# EAGLE design POWER METER (EAGLE 9.6.2)
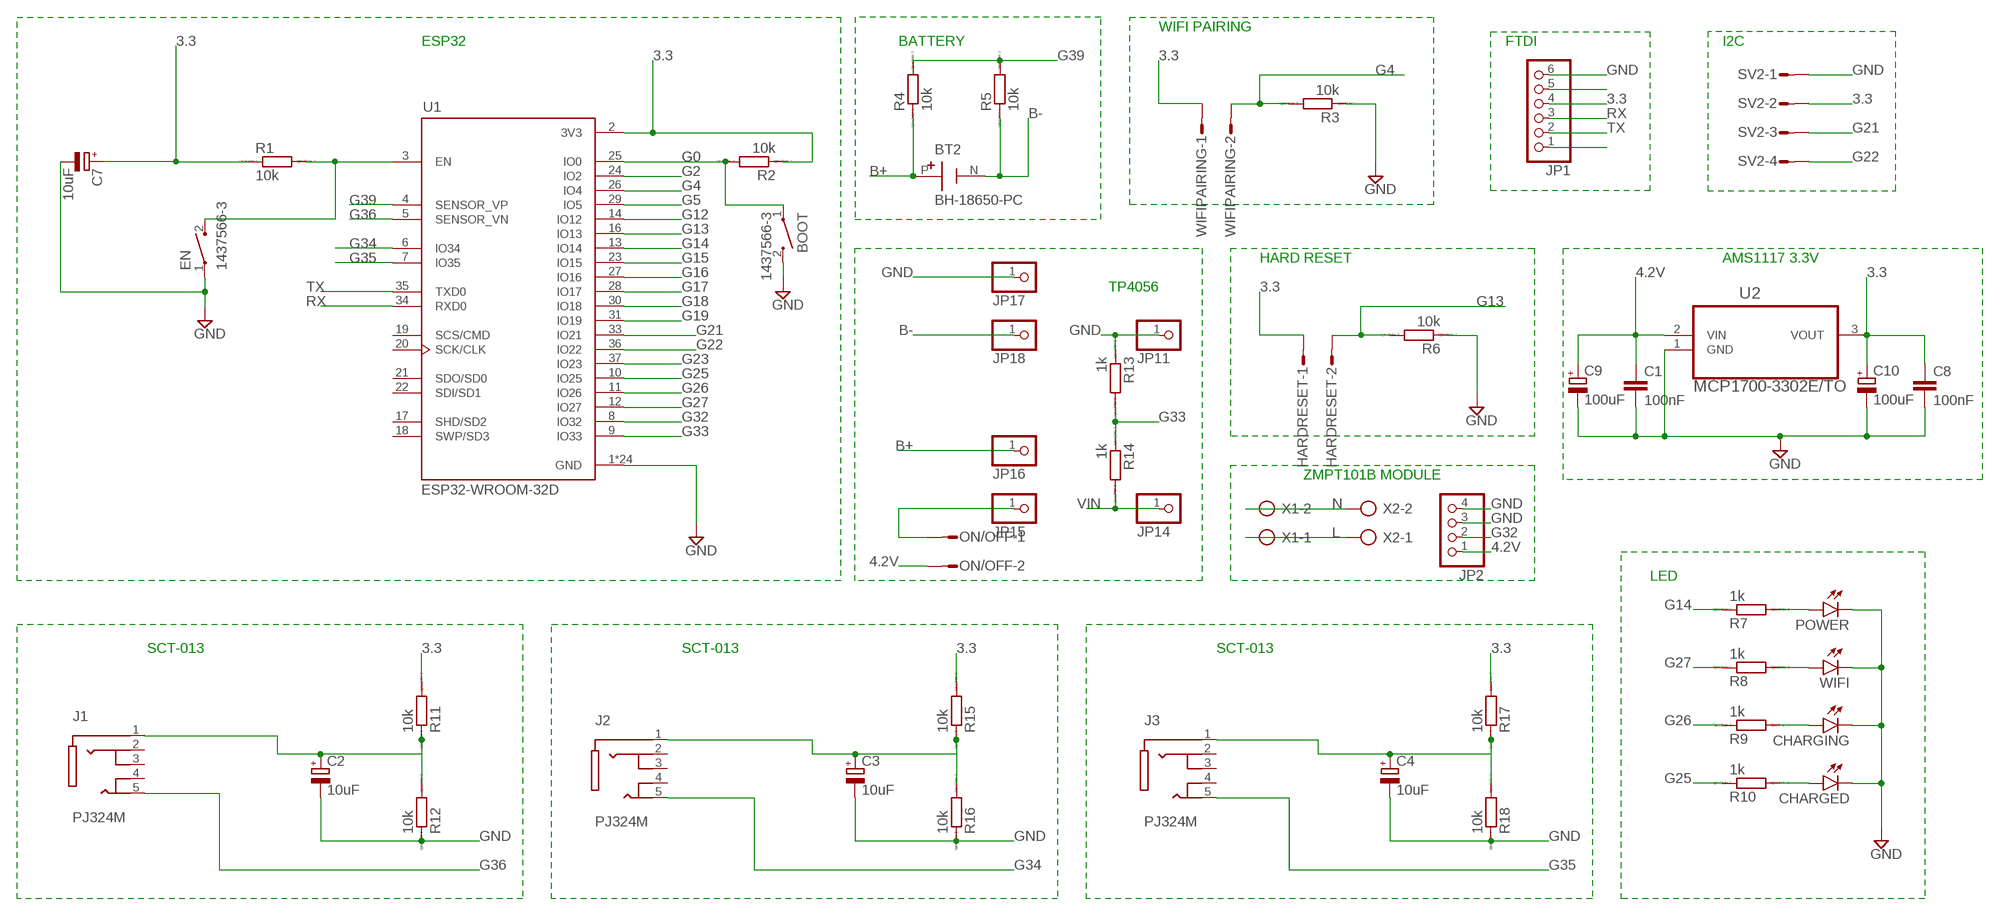
[diagram p0: schematic, sheet 1]

## Parts
BOOT  1437566-3  [SW_1437566-3]
BT2  BH-18650-PC  [BAT_BH-18650-PC]
C1  100nF  C-EUC1206K  [C1206K]
C2  10uF  CPOL-EUE2.5-6  [E2,5-6]
C3  10uF  CPOL-EUE2.5-6  [E2,5-6]
C4  10uF  CPOL-EUE2.5-6  [E2,5-6]
C7  10uF  CPOL-EUE2.5-6  [E2,5-6]
C8  100nF  C-EUC1206K  [C1206K]
C9  100uF  CPOL-EUE2.5-6  [E2,5-6]
C10  100uF  CPOL-EUE2.5-6  [E2,5-6]
CHARGED  LEDCHIPLED_1206  [CHIPLED_1206]
CHARGING  LEDCHIPLED_1206  [CHIPLED_1206]
EN  1437566-3  [SW_1437566-3]
HARDRESET  S02P  [S02P]
J1  PJ324M  [WENZHOU_PJ324M]
J2  PJ324M  [WENZHOU_PJ324M]
J3  PJ324M  [WENZHOU_PJ324M]
JP1  PINHD-1X6/90  [1X06/90]
JP2  PINHD-1X4  [1X04]
JP11  PINHD-1X1  [1X01]
JP14  PINHD-1X1  [1X01]
JP15  PINHD-1X1  [1X01]
JP16  PINHD-1X1  [1X01]
JP17  PINHD-1X1  [1X01]
JP18  PINHD-1X1  [1X01]
ON/OFF  S02P  [S02P]
POWER  LEDCHIPLED_1206  [CHIPLED_1206]
R1  10k  RR1206  [R1206]
R2  10k  RR1206  [R1206]
R3  10k  RR1206  [R1206]
R4  10k  RR1206  [R1206]
R5  10k  RR1206  [R1206]
R6  10k  RR1206  [R1206]
R7  1k  RR1206  [R1206]
R8  1k  RR1206  [R1206]
R9  1k  RR1206  [R1206]
R10  1k  RR1206  [R1206]
R11  10k  RR1206  [R1206]
R12  10k  RR1206  [R1206]
R13  1k  RR1206  [R1206]
R14  1k  RR1206  [R1206]
R15  10k  RR1206  [R1206]
R16  10k  RR1206  [R1206]
R17  10k  RR1206  [R1206]
R18  10k  RR1206  [R1206]
SV2  S04P  [S04P]
U1  ESP32-WROOM-32D  [MODULE_ESP32-WROOM-32D]
U2  MCP1700-3302E/TO  [TO127P254X495-3]
WIFI  LEDCHIPLED_1206  [CHIPLED_1206]
WIFIPAIRING  S02P  [S02P]
X1  AK500/2  [AK500/2]
X2  AK500/2  [AK500/2]

## Nets
3.3: C7.+ C8.1 C10.+ HARDRESET.1 JP1.4 R1.1 R2.1 R11.2 R15.2 R17.2 SV2.2 U1.2(3V3) U2.3(VOUT) WIFIPAIRING.1
4.2V: C1.1 C9.+ JP2.1 ON/OFF.2 U2.2(VIN)
B+: BT2.P(+) JP16.1 R4.1
B-: BT2.N(-) JP18.1 R5.1
G0: BOOT.1 R2.2 U1.25(IO0)
G2: U1.24(IO2)
G4: R3.2 U1.26(IO4) WIFIPAIRING.2
G5: U1.29(IO5)
G12: U1.14(IO12)
G13: HARDRESET.2 R6.2 U1.16(IO13)
G14: R7.1 U1.13(IO14)
G15: U1.23(IO15)
G16: U1.27(IO16)
G17: U1.28(IO17)
G18: U1.30(IO18)
G19: U1.31(IO19)
G21: SV2.3 U1.33(IO21)
G22: SV2.4 U1.36(IO22)
G23: U1.37(IO23)
G25: R10.1 U1.10(IO25)
G26: R9.1 U1.11(IO26)
G27: R8.1 U1.12(IO27)
G32: JP2.2 U1.8(IO32)
G33: R13.2 R14.1 U1.9(IO33)
G34: J2.5(TIP_2) U1.6(IO34)
G35: J3.5(TIP_2) U1.7(IO35)
G36: J1.5(TIP_2) U1.5(SENSOR_VN)
G39: R4.2 R5.2 U1.4(SENSOR_VP)
GND: BOOT.2 C1.2 C2.- C3.- C4.- C7.- C8.2 C9.- C10.- CHARGED.C CHARGING.C EN.1 JP1.6 JP2.3 JP2.4 JP11.1 JP17.1 POWER.C R3.1 R6.1 R12.1 R13.1 R16.1 R18.1 SV2.1 U1.1(GND) U1.15(GND) U1.38(GND) U1.39_1(GND) U1.39_2(GND) U1.39_3(GND) U1.39_4(GND) U1.39_5(GND) U1.39_6(GND) U1.39_7(GND) U1.39_8(GND) U1.39_9(GND) U1.39_10(GND) U1.39_11(GND) U1.39_12(GND) U1.39_13(GND) U1.39_14(GND) U1.39_15(GND) U1.39_16(GND) U1.39_17(GND) U1.39_18(GND) U1.39_19(GND) U1.39_20(GND) U1.39_21(GND) U2.1(GND) WIFI.C
L: X1.1 X2.1
N: X1.2 X2.2
N$1: EN.2 R1.2 U1.3(EN)
N$5: POWER.A R7.2
N$8: JP15.1 ON/OFF.1
N$9: R8.2 WIFI.A
N$10: CHARGING.A R9.2
N$11: CHARGED.A R10.2
N$15: JP1.5
N$19: C2.+ J1.1(SLEEVE) R11.1 R12.2
N$22: JP1.1
N$23: C4.+ J3.1(SLEEVE) R17.1 R18.2
N$26: C3.+ J2.1(SLEEVE) R15.1 R16.2
RX: JP1.3 U1.34(RXD0)
TX: JP1.2 U1.35(TXD0)
VIN: JP14.1 R14.2
Unconnected: J1.2(RING_1) J1.3(RING_2) J1.4(TIP_1) J2.2(RING_1) J2.3(RING_2) J2.4(TIP_1) J3.2(RING_1) J3.3(RING_2) J3.4(TIP_1) U1.17(SHD/SD2) U1.18(SWP/SD3) U1.19(SCS/CMD) U1.20(SCK/CLK) U1.21(SDO/SD0) U1.22(SDI/SD1)

## Notes on the sheet
- WIFI PAIRING
- ESP32 | BATTERY | FTDI | I2C
- HARD RESET | AMS1117 3.3V
- TP4056
- ZMPT101B MODULE
- LED
- SCT-013 | SCT-013 | SCT-013

## Library data of the parts
BOOT EN = TACTILE:1437566-3: Switch Tactile OFF (ON) SPST Rectangular Button Gull Wing 0.05A 12VDC SMD Loose Piece Check availability <https://pricing.snapeda.com/parts/1437566-3/TE%20Connectivity/view-part?ref=eda>; AVAILABILITY: In Stock; CHECK_PRICES: https://www.snapeda.com/parts/1437566-3/TE+Connectivity+ALCOSWITCH+Switches/view-part/?ref=eda; COMMENT: 1437566-3; CONFIGURATION_POLE-THROW: Single Pole - Single Throw; CONTACT_CURRENT_RATING: 50 mA; DESCRIPTION: FSMSM=3.5X6 SMT TACT | TE Connectivity 1437566-3; MF: TE Connectivity; MP: 1437566-3; PACKAGE: None; PRICE: None; SNAPEDA_LINK: https://www.snapeda.com/parts/1437566-3/TE+Connectivity+ALCOSWITCH+Switches/view-part/?ref=snap
BT2 = BH-18650-PC:BH-18650-PC: Check availability <https://pricing.snapeda.com/parts/BH-18650-PC/MPD%20%28Memory/view-part?ref=eda>; AVAILABILITY: In Stock; CHECK_PRICES: https://www.snapeda.com/parts/BH-18650-PC/MPD+%2528Memory+Protection+Devices%2529/view-part/?ref=eda; DESCRIPTION: Battery Holder (Open) 18650 1 Cell PC Pin; MF: MPD (Memory; MP: BH-18650-PC; PACKAGE: None; PRICE: None; SNAPEDA_LINK: https://www.snapeda.com/parts/BH-18650-PC/MPD+%2528Memory+Protection+Devices%2529/view-part/?ref=snap
C1 C8 = rcl:C-EU: CAPACITOR, European symbol; SPICEPREFIX: C
C2-C4 C7 C9 C10 = rcl:CPOL-EU: POLARIZED CAPACITOR, European symbol; SPICEPREFIX: C
CHARGED CHARGING POWER WIFI = led:LED: LED OSRAM: - CHIPLED LG R971, LG N971, LY N971, LG Q971, LY Q971, LO R971, LY R971 LH N974, LH R974 LS Q976, LO Q976, LY Q976 LO Q996 - Hyper CHIPLED LW Q18S LB Q993, LB Q99A, LB R99A - SideLED LS A670, LO A670, LY A670, LG A670, LP A670 LB A673, LV A673, LT A673, LW A673 LH A674 LY A675 LS A676, LA A676, LO A676, LY A676, LW A676 LS A679, LY A679, LG A679 - Hyper Micro SIDELED® LS Y876, LA Y876, LO Y876, LY Y876 LT Y87S - SmartLED LW L88C, LW L88S LB L89C, LB L89S, LG L890 LS L89K, LO L89K, LY L89K LS L896, LA L896, LO L896, LY L896 - TOPLED LS T670, LO T670, LY T670, LG T670, LP T670 LSG T670, LSP T670, LSY T670, LOP T670, LYG T670 LG T671, LOG T671, LSG T671 LB T673, LV T673, LT T673, LW T673 LH T674 LS T676, LA T676, LO T676, LY T676, LB T676, LH T676, LSB T676, LW T676 LB T67C, LV T67C, LT T67C, LS T67K, LO T67K, LY T67K, LW E67C LS E67B, LA E67B, LO E67B, LY E67B, LB E67C, LV E67C, LT E67C LW T67C LS T679, LY T679, LG T679 LS T770, LO T770, LY T770, LG T770, LP T770 LB T773, LV T773, LT T773, LW T773 LH T774 LS E675, LA E675, LY E675, LS T675 LS T776, LA T776, LO T776, LY T776, LB T776 LHGB T686 LT T68C, LB T68C - Hyper Mini TOPLED® LB M676 - Mini TOPLED Santana® LG M470 LS M47K, LO M47K, LY M47K Source: http://www.osram.convergy.de LUXEON: - LUMILED® LXK2-PW12-R00, LXK2-PW12-S00, LXK2-PW14-U00, LXK2-PW14-V00 LXK2-PM12-R00, LXK2-PM12-S00, LXK2-PM14-U00 LXK2-PE12-Q00, LXK2-PE12-R00, LXK2-PE12-S00, LXK2-PE14-T00, LXK2-PE14-U00 LXK2-PB12-K00, LXK2-PB12-L00, LXK2-PB12-M00, LXK2-PB14-N00, LXK2-PB14-P00, LXK2-PB14-Q00 LXK2-PR12-L00, LXK2-PR12-M00, LXK2-PR14-Q00, LXK2-PR14-R00 LXK2-PD12-Q00, LXK2-PD12-R00, LXK2-PD12-S00 LXK2-PH12-R00, LXK2-PH12-S00 LXK2-PL12-P00, LXK2-PL12-Q00, LXK2-PL12-R00 Source: www.luxeon.com KINGBRIGHT: KA-3528ASYC Source: www.kingbright.com
HARDRESET ON/OFF WIFIPAIRING = con-amp-mt:S02P: AMP MT CONNECTOR; OC_FARNELL: unknown; OC_NEWARK: unknown
J1-J3 = PJ324M:PJ324M: Check availability <https://pricing.snapeda.com/parts/PJ324M/Wenzhou%20QingPu%20Electronics%20Co.Ltd/view-part?ref=eda>; AVAILABILITY: Not in stock; CHECK_PRICES: https://www.snapeda.com/parts/PJ324M/Wenzhou+QingPu+Electronics+Co.Ltd/view-part/?ref=eda; DESCRIPTION: Headphone Stereo jack/Audio connector; MF: Wenzhou QingPu Electronics Co.Ltd; MP: PJ324M; PACKAGE: Package; PRICE: None; SNAPEDA_LINK: https://www.snapeda.com/parts/PJ324M/Wenzhou+QingPu+Electronics+Co.Ltd/view-part/?ref=snap
JP1 = pinhead:PINHD-1X6: PIN HEADER
JP2 = pinhead:PINHD-1X4: PIN HEADER
JP11 JP14-JP18 = pinhead:PINHD-1X1: PIN HEADER
R1-R18 = eagle-ltspice:R: RESISTOR, European symbol; SPICEMODEL: NONE; SPICEPREFIX: R
SV2 = con-amp-mt:S04P: AMP MT CONNECTOR; OC_FARNELL: unknown; OC_NEWARK: unknown
U1 = ESP32-WROOM-32D (1):ESP32-WROOM-32D: Bluetooth, WiFi 802.11b/g/n, Bluetooth v4.2 + EDR, Class 1, 2 and 3 Transceiver Module 2.4GHz ~ 2.5GHz Integrated, Trace Surface Mount Check availability <https://pricing.snapeda.com/parts/ESP32-WROOM-32D/Espressif%20Systems/view-part?ref=eda>; AVAILABILITY: In Stock; CHECK_PRICES: https://www.snapeda.com/parts/ESP32-WROOM-32D/Espressif+Systems/view-part/?ref=eda; DESCRIPTION: Bluetooth, WiFi 802.11b/g/n, Bluetooth v4.2 +EDR, Class 1, 2 and 3 Transceiver Module 2.4GHz ~ 2.5GHz Integrated; MF: Espressif Systems; MP: ESP32-WROOM-32D; PACKAGE: Non Standard Espressif Systems; PRICE: None; SNAPEDA_LINK: https://www.snapeda.com/parts/ESP32-WROOM-32D/Espressif+Systems/view-part/?ref=snap
U2 = MCP1700-3302E_TO:MCP1700-3302E/TO: Check availability <https://pricing.snapeda.com/parts/MCP1700-3302E/TO/Microchip/view-part?ref=eda>; AVAILABILITY: In Stock; CHECK_PRICES: https://www.snapeda.com/parts/MCP1700-3302E/TO/Microchip/view-part/?ref=eda; DESCRIPTION: Pwr Sply Func,Voltage Regulator,LDO,TO-92,PD 644mW,VO 3.3V,Regline +/-0.75%/V | Microchip Technology Inc. MCP1700-3302E/TO; MF: Microchip; MP: MCP1700-3302E/TO; PACKAGE: TO-92 Supertex; PRICE: None; SNAPEDA_LINK: https://www.snapeda.com/parts/MCP1700-3302E/TO/Microchip/view-part/?ref=snap
X1 X2 = con-ptr500:AK500/2: CONNECTOR; OC_FARNELL: unknown; OC_NEWARK: unknown

## Board
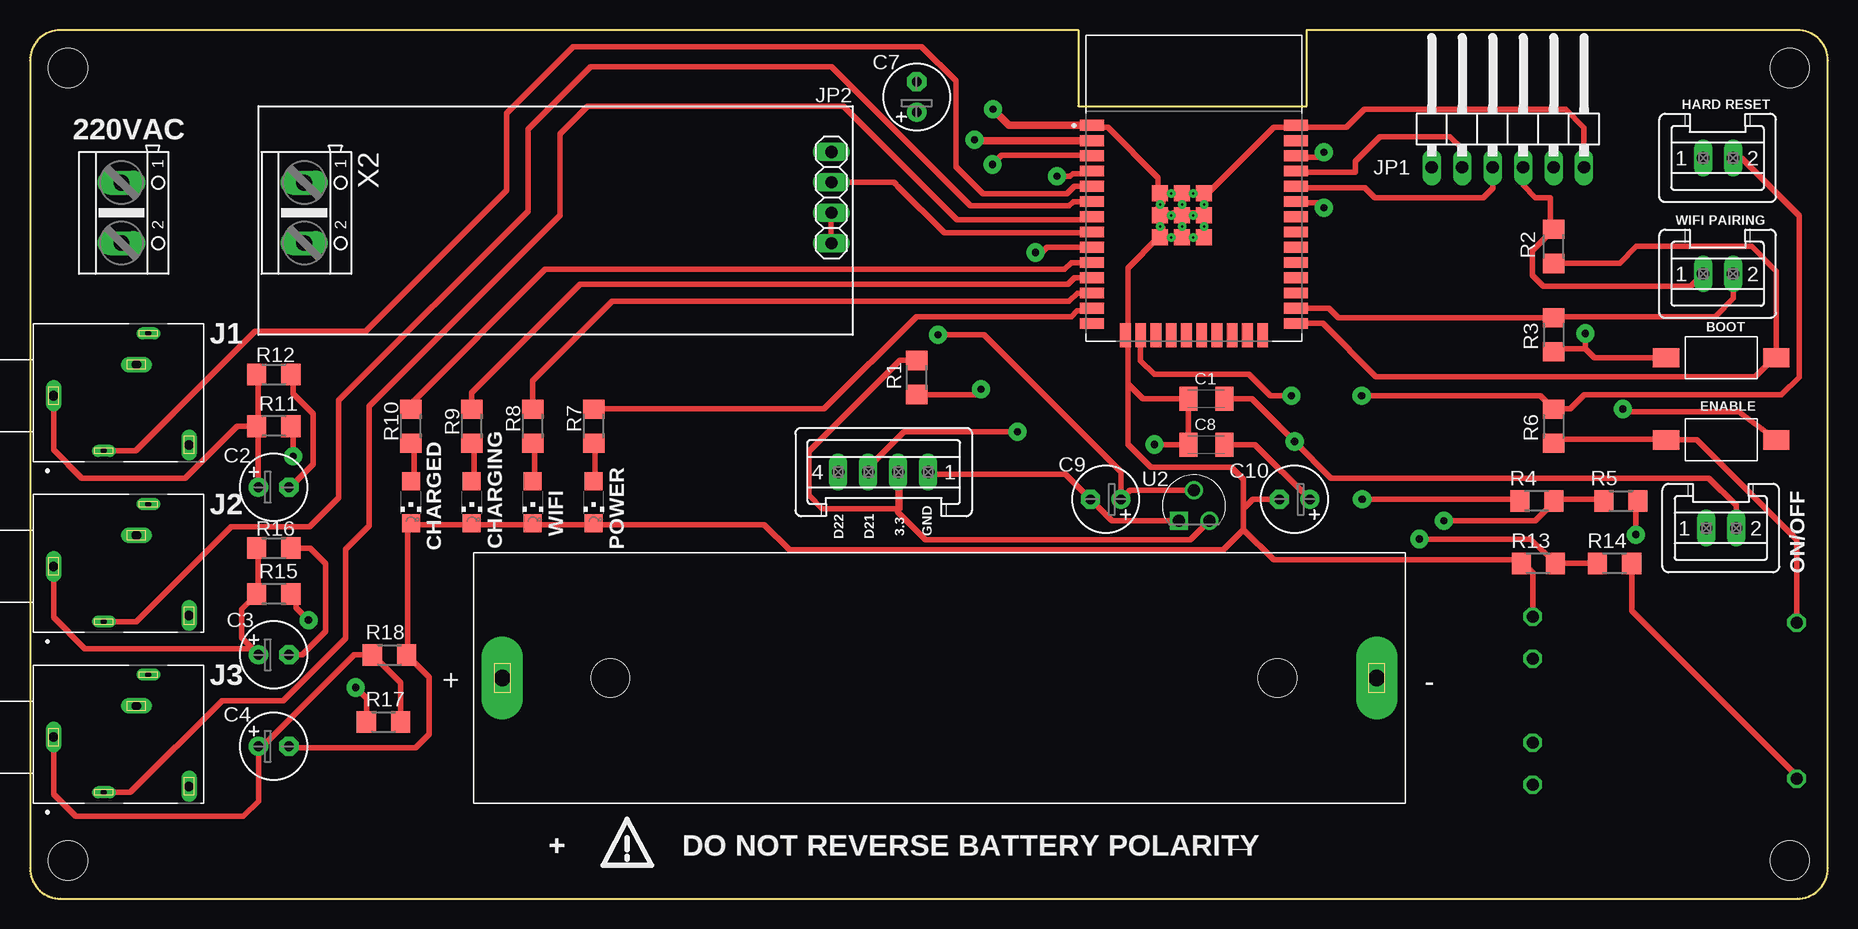
[diagram p1: board, top side]
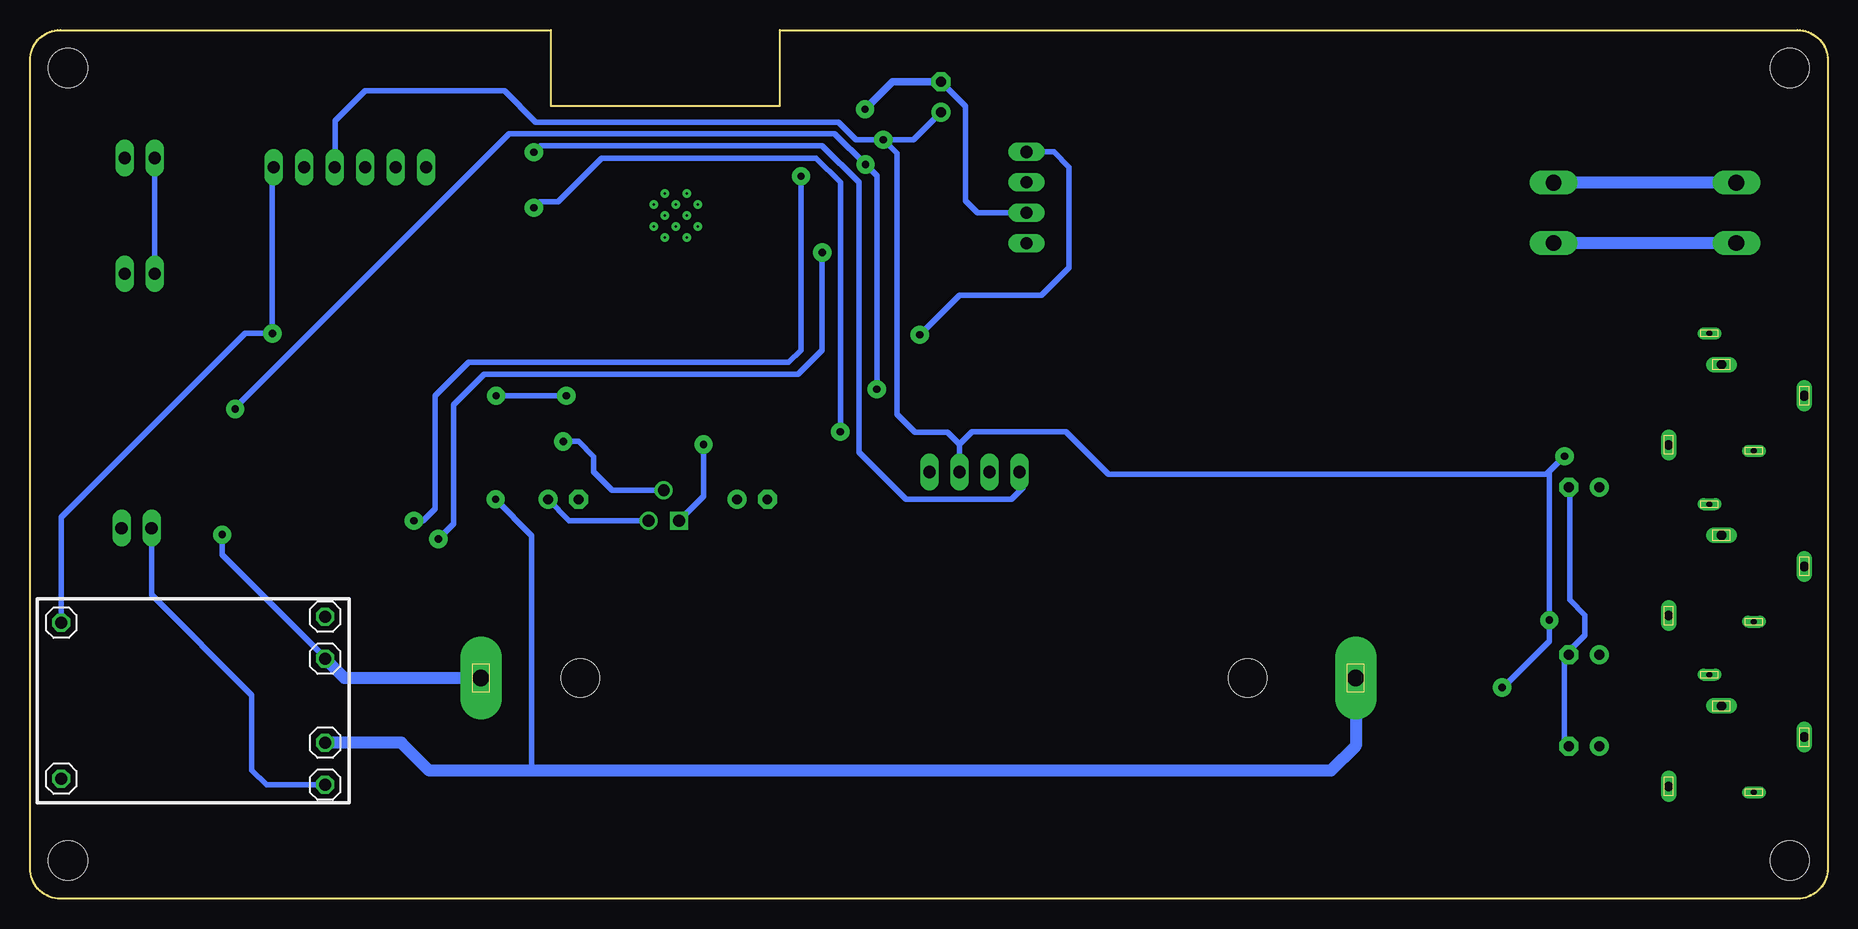
[diagram p2: board, bottom side, seen from below]

Size 149.86 x 72.39 mm. Coordinates in mm from the lower left corner, seen from the top.
Outline: 147.32,72.39 106.43,72.39 106.43,66.04 87.38,66.04 87.38,72.39 2.54,72.39 arc90 0,69.85 0,2.54 arc90 2.54,0 147.32,0 arc90 149.86,2.54 149.86,69.85 arc90 147.32,72.39
Copper layers (1*16): Top 0.035mm / dielectric 1.5mm / Bottom 0.035mm
Design rules "default *": minimum track width 18mil, minimum drill 0.6mm, track to track 15mil, track to pad 15mil, pad to pad 15mil, via to via 15mil, smd to smd 15mil, copper to edge 40mil, drill to drill 6mil, minimum pad ring 10mil, minimum via ring 18mil, stop-mask expansion 4mil, vias tented up to drill 0mil, thermal gap 10mil
Holes 3.25 mm at 3.17,69.22 3.17,3.18 146.69,3.18 146.69,69.22
vRestrict: area 86.9,45.5 to 106.9,65.5

### Footprints (pad centres in the part's own frame; a part is rotated, then mirrored left to right if it is on the bottom)
SW_1437566-3 = smd 2.18 x 1.6: 1 -4.6,0; 2 4.6,0
BAT_BH-18650-PC = drill 1.38 pad 3.44 long: N -36.45,0; P 36.45,0 | hole 3.2: -28.17,0; 27.44,0
C1206K = smd 1.5 x 2: 1 -1.5,0; 2 1.5,0
E2,5-6 = drill 0.813 pad 1.6: + -1.27,0 | drill 0.813 pad 1.6 octagon: - 1.27,0
CHIPLED_1206 = smd 1.5 x 1.5: A 0,-1.75; C 0,1.75
S02P = drill 1.016 long: 1 1.25,0; 2 -1.25,0
WENZHOU_PJ324M = drill 0.8 long: 1 0,5.4; 3 2.6,-1.5; 4 -4.1,-5.9 | drill 0.5 long: 2 5.2,-2.5; 5 -4.6,1.2
1X06/90 = drill 1.016 long: 1 -6.35,-3.81; 2 -3.81,-3.81; 3 -1.27,-3.81; 4 1.27,-3.81; 5 3.81,-3.81; 6 6.35,-3.81
1X04 = drill 1.016 long: 1 -3.81,0; 2 -1.27,0; 3 1.27,0; 4 3.81,0
1X01 = drill 1.016 octagon: 1 0,0
R1206 = smd 1.6 x 1.803: 1 -1.422,0; 2 1.422,0
S04P = drill 1.016 long: 1 3.75,0; 2 1.25,0; 3 -1.25,0; 4 -3.75,0
MODULE_ESP32-WROOM-32D = smd 2 x 0.9: 1 -8.5,5.26; 2 -8.5,3.99; 3 -8.5,2.72; 4 -8.5,1.45; 5 -8.5,0.18; 6 -8.5,-1.09; 7 -8.5,-2.36; 8 -8.5,-3.63; 9 -8.5,-4.9; 10 -8.5,-6.17; 11 -8.5,-7.44; 12 -8.5,-8.71; 13 -8.5,-9.98; 14 -8.5,-11.25; 25 8.5,-11.25; 26 8.5,-9.98; 27 8.5,-8.71; 28 8.5,-7.44; 29 8.5,-6.17; 30 8.5,-4.9; 31 8.5,-3.63; 32 8.5,-2.36; 33 8.5,-1.09; 34 8.5,0.18; 35 8.5,1.45; 36 8.5,2.72; 37 8.5,3.99; 38 8.5,5.26 | smd 0.9 x 2: 15 -5.715,-12.25; 16 -4.445,-12.25; 17 -3.175,-12.25; 18 -1.905,-12.25; 19 -0.635,-12.25; 20 0.635,-12.25; 21 1.905,-12.25; 22 3.175,-12.25; 23 4.445,-12.25; 24 5.715,-12.25 | smd 1.33 x 1.33: 39_1 -2.835,-0.405; 39_2 -1,-0.405; 39_3 0.835,-0.405; 39_4 -2.835,-2.24; 39_5 -1,-2.24; 39_6 0.835,-2.24; 39_7 -2.835,-4.075; 39_8 -1,-4.075; 39_9 0.835,-4.075 | drill 0.2 pad 0.3: 39_10 -1.917,-0.405; 39_11 -0.083,-0.405; 39_12 -2.835,-1.323; 39_13 -1,-1.323; 39_14 0.835,-1.323; 39_15 -1.917,-2.24; 39_16 -0.083,-2.24; 39_17 -2.835,-3.158; 39_18 -1,-3.158; 39_19 0.835,-3.158; 39_20 -1.917,-4.075; 39_21 -0.083,-4.075
TO127P254X495-3 = drill 0.991 square: 1 -2.54,-2.54 | drill 0.991: 2 -1.27,0; 3 0,-2.54
AK500/2 = drill 1.321 long: 1 -2.515,0; 2 2.515,0

### Placement (x,y rotation side)
BOOT  140.97,45.09 180 top
BT2  75.81,18.39 180 top
C1  98.04,41.66 180 top
C2  20.32,34.29 0 top
C3  20.32,20.32 0 top
C4  20.32,12.7 0 top
C7  73.91,66.8 90 top
C8  98.04,37.85 180 top
C9  89.66,33.27 180 top
C10  105.41,33.27 180 top
CHARGED  31.75,33.02 180 top
CHARGING  36.83,33.02 180 top
EN  140.97,38.23 0 top
HARDRESET  140.72,61.72 180 top
J1  7.37,41.91 90 top
J2  7.37,27.69 90 top
J3  7.37,13.46 90 top
JP1  123.19,64.77 0 top
JP2  66.8,58.42 270 top
JP11  147.26,23 0 bottom
JP14  147.26,10 0 bottom
JP15  125.26,9.5 0 bottom
JP16  125.26,13 0 bottom
JP17  125.26,23.5 0 bottom
JP18  125.26,20 0 bottom
ON/OFF  140.98,30.88 180 top
POWER  46.99,33.02 180 top
R1  73.91,43.43 270 top
R2  127,54.36 270 top
R3  127,46.99 90 top
R4  125.6,33.15 0 top
R5  132.6,33.15 180 top
R6  127,39.37 90 top
R7  46.99,39.37 270 top
R8  41.91,39.37 270 top
R9  36.83,39.37 270 top
R10  31.75,39.37 270 top
R11  20.32,39.37 0 top
R12  20.32,43.69 180 top
R13  125.73,27.94 0 top
R14  132.08,27.94 0 top
R15  20.32,25.4 0 top
R16  20.32,29.21 180 top
R17  29.46,14.73 180 top
R18  29.97,20.32 180 top
SV2  71.12,35.56 0 top
U1  97.03,59.18 0 top
U2  98.3,34.04 0 top
WIFI  41.91,33.02 180 top
WIFIPAIRING  140.72,52.07 180 top
X1  7.62,57.15 270 top
X2  22.86,57.15 270 top

### Tracks (layer width: path | path; a pad name or v marks a point on that pad's centre or on a via)
3.3  (via drill 0.6)
  Top 0.457: v23.22,23.22 22.2,24.23 22.2,25.2 R15.2 | v21.95,36.88 21.95,39.14 R11.2 | JP1.4 124.46,59.44 125.48,58.42 126.72,58.42 126.72,55.91 R2.1 126.72,55.49 125.21,53.98 125.21,51.97 126.14,51.04 138.44,51.04 WIFIPAIRING.1 | U2.3 96.72,29.92 74.64,29.92 72.32,32.24 72.37,32.32 SV2.2 72.5,35.47 72.5,32.51 66.03,32.51 64.94,33.6 64.94,37.29 72.5,44.86 R1.1 | C8.1 102.11,37.85 C10.+ | v27.15,17.6 28.04,16.71 R17.2
  Top 0.61: U1.2 78.81,63.17 v78.74,63.25
  Bottom 0.457: v27.15,17.6 27.05,17.6 23.22,21.44 v23.22,23.22 23.2,23.23 23.2,35.37 23.46,35.37 | 23.46,35.37 v21.95,36.88 | SV2.2 72.24,35.79 72.66,36.21 SV2.2 | JP1.4 124.42,61.02 124.42,64.81 121.92,67.31 110.3,67.31 107.7,64.71 82.46,64.71 81,63.25 v78.74,63.25 | 23.46,35.37 59.96,35.37 63.49,38.9 71.34,38.9 72.37,37.87 | 72.37,37.87 SV2.2 | U2.3 104.9,31.5 C10.+ | v78.74,63.25 77.6,62.1 77.6,40.39 76.07,38.86 73.37,38.86 72.37,37.87 | C7.+ 76.2,63.25 v78.74,63.25 | HARDRESET.1 WIFIPAIRING.1
4.2V  (via drill 0.6)
  Top 0.457: U2.2 91.69,34.04 C9.+ 90.93,35.56 79.5,46.99 v75.69,46.99 | C1.1 101.85,41.66 v105.41,38.1 108.46,35.05 139.95,35.05 142.23,32.78 ON/OFF.2
  Bottom 0.457: U2.2 101.35,34.04 102.87,35.56 102.87,36.83 104.14,38.1 v105.41,38.1 | JP2.1 64.52,62.23 63.25,60.96 63.25,52.58 65.53,50.29 72.39,50.29 v75.69,46.99
B+  (via drill 0.6)
  Top 0.457: v111.05,33.27 123.79,33.27 R4.1
  Bottom 0.457: v111.05,33.27 108.04,30.26 108.04,10.67
  Bottom 1.016: BT2.P 39.36,12.71 41.4,10.67 108.04,10.67 116.59,10.67 118.92,13 JP16.1
B-  (via drill 0.6)
  Top 0.457: v133.84,30.34 133.84,32.86 R5.1
  Bottom 0.457: v133.84,30.34 133.84,28.66 125.46,20.28 JP18.1
  Bottom 1.016: BT2.N 123.65,18.39 JP18.1
G0
  Top 0.457: R2.2 127.14,52.97 132.51,52.97 133.9,54.36 143.51,54.36 145.57,52.3 BOOT.1 145.49,45.16 143.83,43.5 112.2,43.5 107.77,47.93 U1.25
G4
  Top 0.457: U1.26 108.28,49.2 109.07,48.41 R3.2 127.1,48.51 140.46,48.51 141.99,50.04 141.99,52.05 WIFIPAIRING.2
G13  (via drill 0.6)
  Top 0.457: U1.16 92.58,44.83 93.73,43.69 101.6,43.69 103.38,41.91 v105.16,41.91 | v111,41.91 125.88,41.91 R6.2 127.14,40.82 128.4,40.82 129.55,41.97 146,41.97 147.5,43.47 147.5,56.92 142.7,61.72 HARDRESET.2
  Bottom 0.457: v111,41.91 v105.16,41.91
G14
  Top 0.457: R7.1 47.09,40.82 66.2,40.82 73.9,48.51 86.8,48.51 87.28,48.99 87.95,48.99 88.16,49.2 U1.13
G21  (via drill 0.6)
  Top 0.457: v107.86,57.58 107.44,58 105.77,58 U1.33 | v82.32,38.9 72.83,38.9 69.72,35.79 SV2.3
  Bottom 0.457: v107.86,57.58 107.35,58.09 105.83,58.09 102.2,61.72 84.33,61.72 82.3,59.69 82.3,38.93 v82.32,38.9
G22  (via drill 0.6)
  Top 0.457: v107.86,62.19 107.44,61.77 105.77,61.77 U1.36
  Bottom 0.457: SV2.4 67.37,35.31 67.7,34.98 67.07,34.24 68.03,33.27 76.85,33.27 80.77,37.2 80.77,59.69 83.82,62.74 107.31,62.74 v107.86,62.19
G25
  Top 0.457: R10.1 31.75,41.26 42.95,52.46 86.25,52.46 86.79,53.01 U1.10
G26
  Top 0.457: R9.1 36.83,42.16 45.87,51.21 86.51,51.21 87.05,51.74 U1.11
G27
  Top 0.457: R8.1 41.91,43.18 48.51,49.78 86.61,49.78 87.3,50.47 U1.12
G32
  Top 0.457: U1.8 88.16,55.49 76.22,55.49 72.33,59.38 72.19,59.52 72.02,59.69 JP2.2
G33  (via drill 0.6)
  Top 0.457: U1.9 84.76,54.28 84.33,53.85 v83.82,53.85 | v115.82,29.97 125.12,29.97 R13.2 R14.1
  Bottom 0.457: v83.82,53.85 83.82,45.72 85.85,43.69 112.01,43.69 114.55,41.15 114.55,31.24 v115.82,29.97
G34
  Top 0.457: J2.5 8.86,23.09 16.76,30.99 23.29,30.99 25.73,33.43 25.73,41.53 41.5,57.3 41.5,64.11 46.74,69.34 66.8,69.34 78.4,57.75 86.62,57.75 86.96,58.09 U1.6
G35
  Top 0.457: U1.7 88.27,56.57 77.29,56.57 67.82,66.04 46.48,66.04 44.2,63.75 44.2,56.96 28.29,41.05 28.29,31.08 26.31,29.11 26.31,21.7 21.12,16.51 16,16.51 8.35,8.86 J3.5
G36
  Top 0.457: J1.5 8.8,37.31 18.76,47.28 27.97,47.28 39.72,59.02 39.72,65.44 45.28,70.99 74.33,70.99 77.18,68.15 77.18,61 79.43,58.75 86.44,58.75 87.05,59.36 U1.5
G39  (via drill 0.6)
  Top 0.457: v85.6,60.2 86.7,60.2 86.92,60.42 88.32,60.42 U1.4 | 127.25,33.27 130.91,33.27 R5.2 | 127.25,33.27 127.14,33.27 R4.2 | v117.86,31.5 125.48,31.5 127.25,33.27
  Bottom 0.457: v85.6,60.2 85.6,45.72 86.61,44.7 113.28,44.7 116.08,41.91 116.08,32.51 117.09,31.5 v117.86,31.5
GND  (via drill 0.6)
  Top 0.457: R6.1 127.14,38.3 136.29,38.3 EN.1 138.95,38.23 147.26,29.92 147.26,23.22 JP11.1 | JP2.4 66.79,54.65 66.79,56.74 JP2.3 | 96.13,57.16 96.13,57.58 U1.39_13 | U1.39_5 95.71,57.16 95.29,57.16 U1.39_15 94.87,57.16 94.45,57.16 U1.39_4 94.03,57.16 94.03,57.58 U1.39_12 94.45,58 94.45,58.42 U1.39_1 | 96.13,57.16 96.97,57.16 | 96.13,57.16 U1.39_5 | U1.39_1 94.45,58.84 94.87,58.84 U1.39_10 95.29,58.84 95.71,58.84 U1.39_2 96.13,58.84 96.97,58.84 U1.39_11 | U1.39_7 94.45,55.07 94.87,55.07 U1.39_20 95.29,55.07 95.71,55.07 U1.39_8 | U1.39_21 96.97,55.07 96.13,55.07 U1.39_8 | U1.39_17 94.45,55.91 94.45,55.49 U1.39_7 | U1.39_8 96.13,55.49 96.13,55.91 U1.39_18 96.13,56.32 96.13,56.74 U1.39_5 | U1.39_7 94.03,55.07 91.52,52.55 91.52,47.1 U1.15 91.52,46.68 91.52,42.93 | 129.65,45.85 127.14,45.85 R3.1 | U1.39_9 97.8,55.49 97.8,55.91 U1.39_19 97.8,56.32 97.8,56.74 U1.39_6 97.8,57.16 | 97.8,57.16 97.8,57.58 U1.39_14 97.8,58 97.8,58.42 U1.39_3 98.22,58.84 103.67,64.29 105.35,64.29 U1.38 105.77,64.29 109.73,64.29 111.23,65.79 128.02,65.79 129.54,64.26 JP1.6 | v129.65,47.1 129.65,45.85 | 97.8,57.16 96.97,57.16 | 96.97,57.16 U1.39_16 | U1.1 88.58,64.29 89.84,64.29 94.03,60.1 94.03,58.84 U1.39_1 | R12.1 21.95,43.41 21.95,42.07 23.62,40.4 23.62,36.21 21.95,34.53 C2.- | R16.1 23.35,29.21 24.64,27.93 24.64,22.29 22.67,20.32 C3.- | C4.- 21.71,12.57 32.13,12.57 33.27,13.72 33.27,18.44 R18.1 31.5,20.42 31.5,31.02 CHARGED.C 32,31.18 36.61,31.18 CHARGING.C 37.03,31.18 41.64,31.18 WIFI.C 42.06,31.18 46.67,31.18 POWER.C 47.09,31.18 61.2,31.18 63.3,29.08 99.48,29.08 101.16,30.76
  Top 0.457: 101.16,32.51 101.16,34.95 100.15,35.95 93.43,35.95 91.52,37.87 91.52,42.93 | 101.16,32.51 101.16,30.76 | SV2.1 75.17,35.37 86.3,35.37 C9.- 90.17,31.5 U2.1 | 124,28.25 124.21,28.25 125.26,27.19 JP17.1 | 101.16,30.76 103.67,28.25 123.95,28.25 124,28.25 | 101.16,32.51 101.92,33.27 C10.- | 91.52,42.93 92.79,41.66 C1.2 C8.2 v93.73,37.85 | BOOT.2 130.42,45.09 129.65,45.85 | R13.1 124,28.25
  Top 0.61: v80.26,65.79 81.61,64.44 U1.1
  Bottom 0.457: JP1.6 129.65,60.93 v129.65,47.1 131.94,47.1 147.26,31.79 147.26,23.22 JP11.1 | C4.- 21.95,12.74 21.95,20.28 C3.- 21.53,20.7 20.27,21.96 20.27,23.63 21.53,24.89 21.53,34.11 C2.- | JP2.3 70.87,57.15 71.88,58.17 71.88,66.04 C7.- | U2.1 93.73,33.53 v93.73,37.85
  Bottom 0.61: v80.26,65.79 77.98,68.07 C7.-
L
  Bottom 1.016: X1.1 X2.1
N
  Bottom 1.016: X1.2 X2.2
N$1  (via drill 0.6)
  Top 0.457: v132.77,40.8 133.01,40.56 142.43,40.56 EN.2 | v79.27,42.44 78.84,42.01 R1.2 | U1.3 88.48,61.95 80.98,61.95 v80.23,61.19
  Bottom 0.457: v132.77,40.8 132.77,40.91 109.92,63.75 82.79,63.75 v80.23,61.19 79.27,60.24 v79.27,42.44
N$5
  Top 0.457: POWER.A 47.09,34.95 47.09,37.88 R7.2
N$8
  Bottom 0.457: ON/OFF.1 139.71,30.76 139.71,25.31 131.37,16.97 131.37,10.72 130.15,9.5 JP15.1
N$9
  Top 0.457: WIFI.A 42.06,34.95 42.06,37.88 R8.2
N$10
  Top 0.457: CHARGING.A 37.03,34.95 37.03,37.88 R9.2
N$11
  Top 0.457: CHARGED.A 32,34.95 32,37.88 R10.2
N$19
  Top 0.457: R11.1 19.01,39.56 19.01,43.41 R12.2 | R11.1 17.27,39.37 12.95,35.05 4.32,35.05 1.97,37.4 J1.1 | C2.+ 19.01,34.53 19.01,39.14 R11.1
N$23
  Top 0.457: J3.1 1.97,8.7 3.81,6.86 17.78,6.86 19.05,8.13 19.05,12.28 19.01,12.32 C4.+ 19.43,12.74 27.01,20.32 R18.2 30.89,17.98 R17.1
N$26
  Top 0.457: R16.2 19.01,29.08 19.01,25.73 R15.1 17.63,24.13 17.63,21.74 C3.+ 18.54,20.83 4.57,20.83 1.97,23.43 J2.1
RX
  Top 0.457: U1.34 105.77,59.26 111.25,59.26 112.09,58.42 121.16,58.42 121.92,59.18 JP1.3
TX
  Top 0.457: U1.35 105.77,60.52 110.49,60.52 110.49,61.47 112.52,63.5 118.36,63.5 119.38,62.48 JP1.2
VIN
  Top 0.457: JP14.1 147.26,10.22 133.5,23.98 R14.2

### Text on the board
tPlace: HARD RESET | 220VAC | WIFI PAIRING | BOOT | J1 | ENABLE | J2 | 3.3 | GND | D22 | D21 | J3 | _ | + | DO NOT REVERSE BATTERY POLARITY